# EAGLE design merkur-22m0 (EAGLE 6.3)
REVISION: 1.0
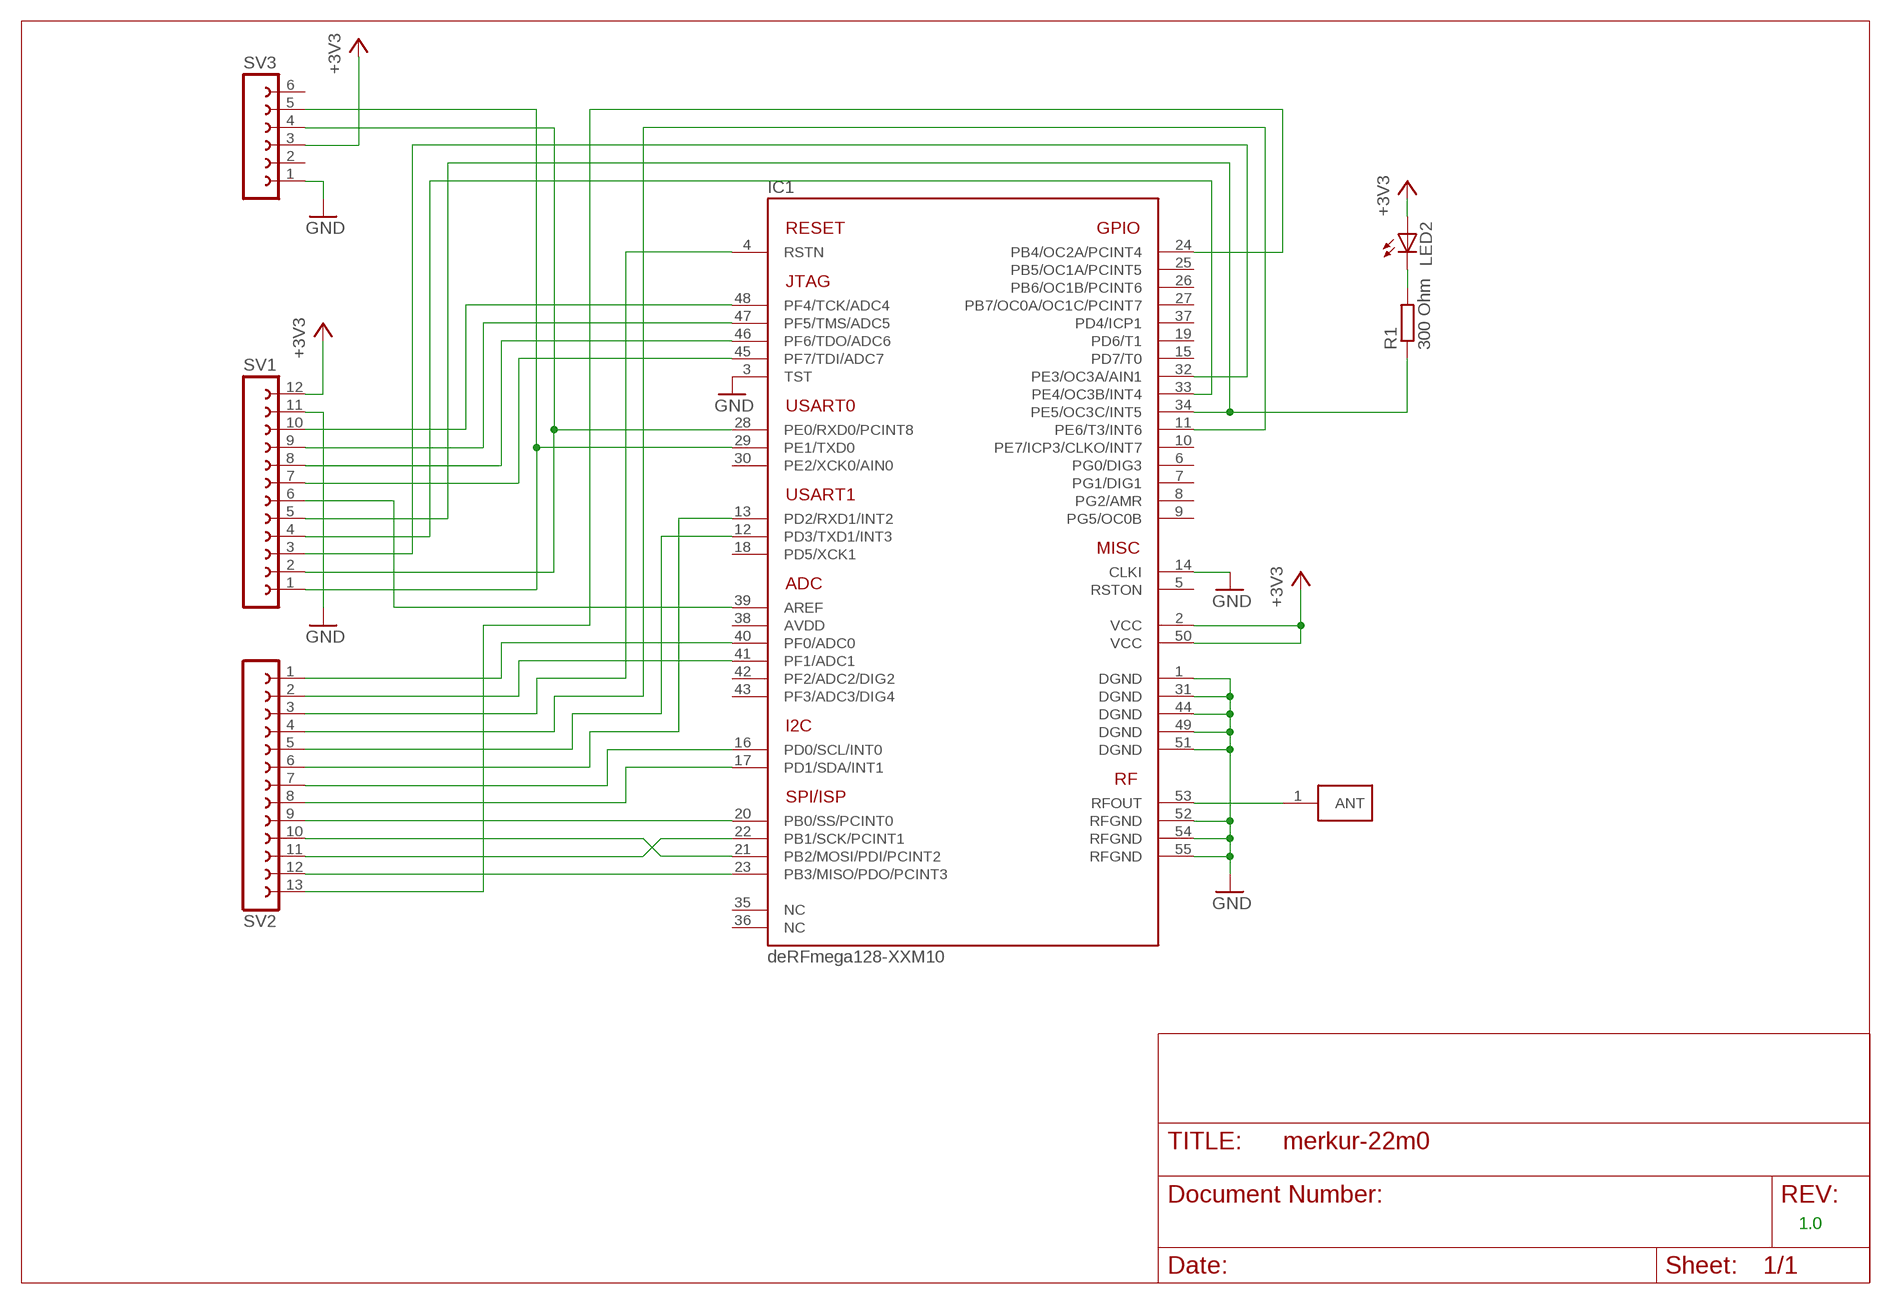
[diagram p0: schematic, sheet 1]

## Parts
IC1  DERFMEGA128-XXM10  [A-M10]
LED2  LEDCHIP-LED0603  [CHIP-LED0603]
R1  300 Ohm  R-EU_R0603  [R0603]
SV1  FE12-1  [FE12]
SV2  FE13-1  [FE13]
SV3  FE06-1  [FE06]
U$1  PAD  [FE05-1]

## Nets
+3V3: IC1.2(VCC) IC1.50(VCC) LED2.A SV1.12 SV3.3
GND: IC1.1(DGND) IC1.3(TST) IC1.14(CLKI) IC1.31(DGND) IC1.44(DGND) IC1.49(DGND) IC1.51(DGND) IC1.52(RFGND) IC1.54(RFGND) IC1.55(RFGND) SV1.11 SV3.1
N$1: IC1.29(PE1/TXD0) SV1.1 SV3.5
N$2: IC1.28(PE0/RXD0/PCINT8) SV1.2 SV3.4
N$3: IC1.45(PF7/TDI/ADC7) SV1.7
N$4: IC1.46(PF6/TDO/ADC6) SV1.8
N$5: IC1.47(PF5/TMS/ADC5) SV1.9
N$6: IC1.48(PF4/TCK/ADC4) SV1.10
N$7: IC1.4(RSTN) SV2.3
N$8: IC1.34(PE5/OC3C/INT5) R1.1 SV1.5
N$9: IC1.33(PE4/OC3B/INT4) SV1.4
N$10: IC1.32(PE3/OC3A/AIN1) SV1.3
N$11: IC1.17(PD1/SDA/INT1) SV2.8
N$12: IC1.16(PD0/SCL/INT0) SV2.7
N$13: IC1.20(PB0/SS/PCINT0) SV2.9
N$14: IC1.22(PB1/SCK/PCINT1) SV2.11
N$15: IC1.21(PB2/MOSI/PDI/PCINT2) SV2.10
N$16: IC1.23(PB3/MISO/PDO/PCINT3) SV2.12
N$17: IC1.13(PD2/RXD1/INT2) SV2.6
N$18: IC1.12(PD3/TXD1/INT3) SV2.5
N$19: IC1.11(PE6/T3/INT6) SV2.4
N$20: IC1.41(PF1/ADC1) SV2.2
N$21: IC1.40(PF0/ADC0) SV2.1
N$22: IC1.39(AREF) SV1.6
N$23: LED2.C R1.2
N$24: IC1.24(PB4/OC2A/PCINT4) SV2.13
RFOUT: IC1.53(RFOUT) U$1.1(ANT)
Unconnected: IC1.5(RSTON) IC1.6(PG0/DIG3) IC1.7(PG1/DIG1) IC1.8(PG2/AMR) IC1.9(PG5/OC0B) IC1.10(PE7/ICP3/CLKO/INT7) IC1.15(PD7/T0) IC1.18(PD5/XCK1) IC1.19(PD6/T1) IC1.25(PB5/OC1A/PCINT5) IC1.26(PB6/OC1B/PCINT6) IC1.27(PB7/OC0A/OC1C/PCINT7) IC1.30(PE2/XCK0/AIN0) IC1.35(NC) IC1.36(NC) IC1.37(PD4/ICP1) IC1.38(AVDD) IC1.42(PF2/ADC2/DIG2) IC1.43(PF3/ADC3/DIG4) SV3.2 SV3.6

## Library data of the parts
IC1 = deRFmodules:DERFMEGA128-XXM10: deRFmega128 IEEE 802.15.4 Low Power Wireless Radio Module Microcontroller: Atmel ATmega128RFA1 Transceiver: integrated Manufacturer: dresden elektronik ingenieurtechnik gmbh Website: http://www.dresden-elektronik.de
LED2 = led:LED: LED OSRAM: - CHIPLED LG R971, LG N971, LY N971, LG Q971, LY Q971, LO R971, LY R971 LH N974, LH R974 LS Q976, LO Q976, LY Q976 LO Q996 - Hyper CHIPLED LW Q18S LB Q993, LB Q99A, LB R99A - SideLED LS A670, LO A670, LY A670, LG A670, LP A670 LB A673, LV A673, LT A673, LW A673 LH A674 LY A675 LS A676, LA A676, LO A676, LY A676, LW A676 LS A679, LY A679, LG A679 - Hyper Micro SIDELED® LS Y876, LA Y876, LO Y876, LY Y876 LT Y87S - SmartLED LW L88C, LW L88S LB L89C, LB L89S, LG L890 LS L89K, LO L89K, LY L89K LS L896, LA L896, LO L896, LY L896 - TOPLED LS T670, LO T670, LY T670, LG T670, LP T670 LSG T670, LSP T670, LSY T670, LOP T670, LYG T670 LG T671, LOG T671, LSG T671 LB T673, LV T673, LT T673, LW T673 LH T674 LS T676, LA T676, LO T676, LY T676, LB T676, LH T676, LSB T676, LW T676 LB T67C, LV T67C, LT T67C, LS T67K, LO T67K, LY T67K, LW E67C LS E67B, LA E67B, LO E67B, LY E67B, LB E67C, LV E67C, LT E67C LW T67C LS T679, LY T679, LG T679 LS T770, LO T770, LY T770, LG T770, LP T770 LB T773, LV T773, LT T773, LW T773 LH T774 LS E675, LA E675, LY E675, LS T675 LS T776, LA T776, LO T776, LY T776, LB T776 LHGB T686 LT T68C, LB T68C - Hyper Mini TOPLED® LB M676 - Mini TOPLED Santana® LG M470 LS M47K, LO M47K, LY M47K Source: http://www.osram.convergy.de LUXEON: - LUMILED® LXK2-PW12-R00, LXK2-PW12-S00, LXK2-PW14-U00, LXK2-PW14-V00 LXK2-PM12-R00, LXK2-PM12-S00, LXK2-PM14-U00 LXK2-PE12-Q00, LXK2-PE12-R00, LXK2-PE12-S00, LXK2-PE14-T00, LXK2-PE14-U00 LXK2-PB12-K00, LXK2-PB12-L00, LXK2-PB12-M00, LXK2-PB14-N00, LXK2-PB14-P00, LXK2-PB14-Q00 LXK2-PR12-L00, LXK2-PR12-M00, LXK2-PR14-Q00, LXK2-PR14-R00 LXK2-PD12-Q00, LXK2-PD12-R00, LXK2-PD12-S00 LXK2-PH12-R00, LXK2-PH12-S00 LXK2-PL12-P00, LXK2-PL12-Q00, LXK2-PL12-R00 Source: www.luxeon.com KINGBRIGHT: KA-3528ASYC Source: www.kingbright.com
R1 = rcl:R-EU_: RESISTOR, European symbol
SV1 = con-lsta:FE12-1: FEMALE HEADER; OC_FARNELL: unknown; OC_NEWARK: unknown
SV2 = con-lsta:FE13-1: FEMALE HEADER; OC_FARNELL: unknown; OC_NEWARK: unknown
SV3 = con-lsta:FE06-1: FEMALE HEADER; OC_FARNELL: unknown; OC_NEWARK: unknown
U$1 = Pad:PAD

## Board
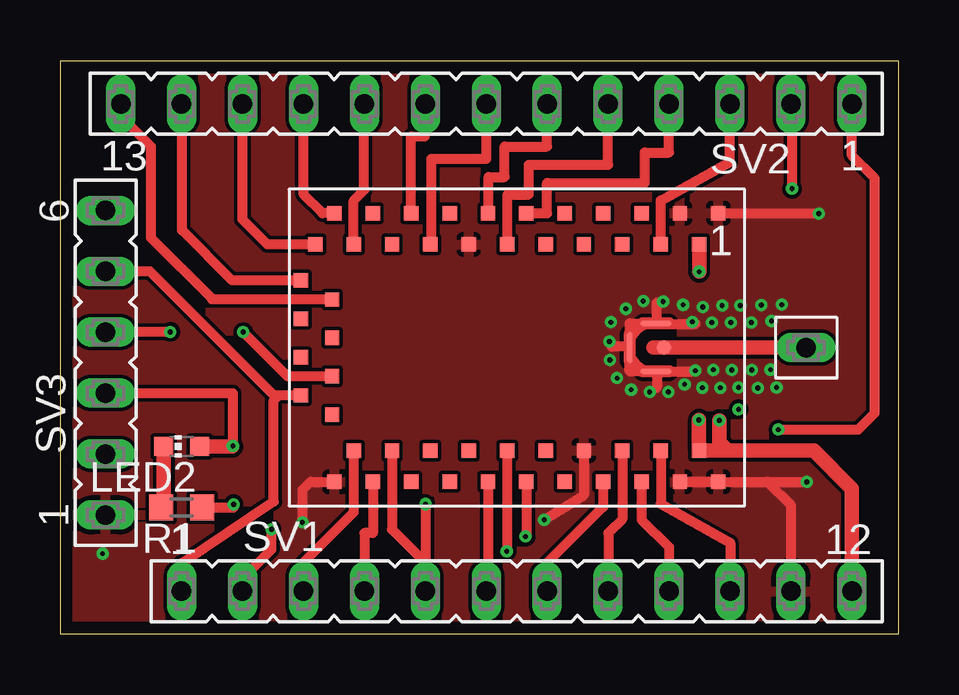
[diagram p1: board, top side]
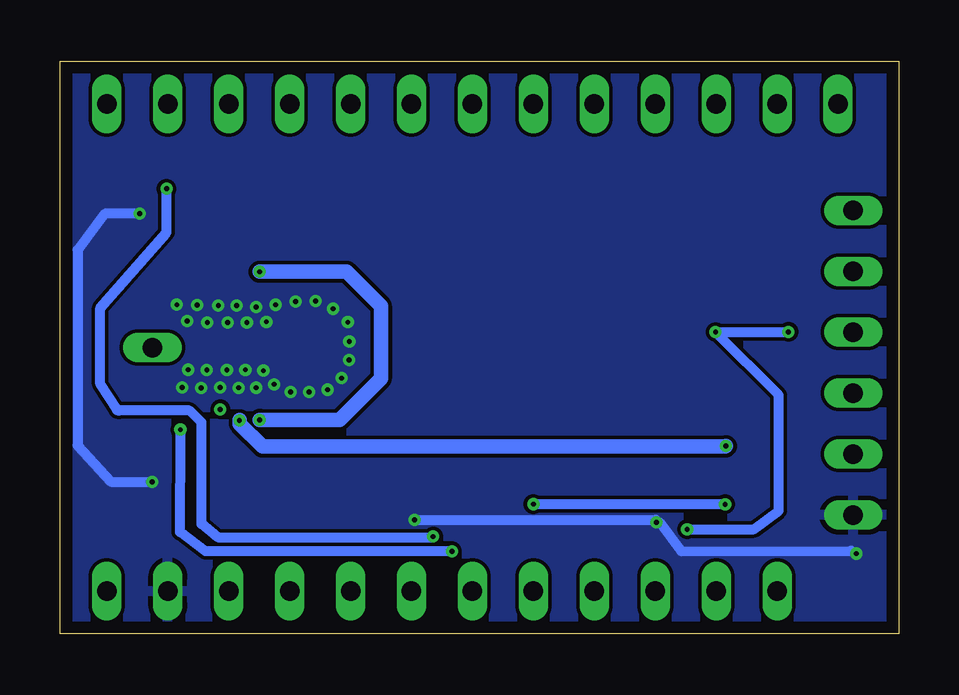
[diagram p2: board, bottom side, seen from below]

Size 34.97 x 23.87 mm. Coordinates in mm from the lower left corner, seen from the top.
Outline: 0,0 34.97,0 34.97,23.87 0,23.87 0,0
Copper layers (1*16): Top 0.035mm / dielectric 1.5mm / Bottom 0.035mm
Design rules "PCB-POOL": minimum track width 6mil, minimum drill 12mil, track to track 6mil, track to pad 6mil, pad to pad 6mil, via to via 6mil, smd to smd 6mil, copper to edge 20mil, drill to drill 8mil, minimum pad ring 8mil, minimum via ring 6mil, stop-mask expansion 3mil, vias tented up to drill 0mil, thermal gap 8mil

### Footprints (pad centres in the part's own frame; a part is rotated, then mirrored left to right if it is on the bottom)
A-M10 = smd 0.6 x 0.6: 1 -8.4,-5.6; 2 -7.6,-4.3; 3 -6.8,-5.6; 4 -6,-4.3; 5 -5.2,-5.6; 6 -4.4,-4.3; 7 -3.6,-5.6; 8 -2.8,-4.3; 9 -2,-5.6; 10 -1.2,-4.3; 11 -0.4,-5.6; 12 0.4,-4.3; 13 1.2,-5.6; 14 2,-4.3; 15 2.8,-5.6; 16 3.6,-4.3; 17 4.4,-5.6; 18 5.2,-4.3; 19 6,-5.6; 20 6.8,-4.3; 21 7.6,-5.6; 22 8.4,-4.3; 23 9,-2.8; 24 7.7,-2; 25 9,-1.2; 26 7.7,-0.4; 27 9,0.4; 28 7.7,1.2; 29 9,2; 30 7.7,2.8; 31 7.6,5.6; 32 6.8,4.3; 33 6,5.6; 34 5.2,4.3; 35 4.4,5.6; 36 3.6,4.3; 37 2.8,5.6; 38 2,4.3; 39 1.2,5.6; 40 0.4,4.3; 41 -0.4,5.6; 42 -1.2,4.3; 43 -2,5.6; 44 -2.8,4.3; 45 -3.6,5.6; 46 -4.4,4.3; 47 -5.2,5.6; 48 -6,4.3; 49 -6.8,5.6; 50 -7.6,4.3; 51 -8.4,5.6; 53 -6.14,0 | smd 1.3 x 0.2: 52 -5.8,1; 54 -5.8,-1 | smd 0.2 x 1.3: 55 -4.7,0
CHIP-LED0603 = smd 0.8 x 0.8: A 0,-0.75; C 0,0.75
R0603 = smd 1 x 1.1: 1 -0.85,0; 2 0.85,0
FE12 = drill 0.813 long: 1 -13.97,0; 2 -11.43,0; 3 -8.89,0; 4 -6.35,0; 5 -3.81,0; 6 -1.27,0; 7 1.27,0; 8 3.81,0; 9 6.35,0; 10 8.89,0; 11 11.43,0; 12 13.97,0
FE13 = drill 0.813 long: 1 -15.24,0; 2 -12.7,0; 3 -10.16,0; 4 -7.62,0; 5 -5.08,0; 6 -2.54,0; 7 0,0; 8 2.54,0; 9 5.08,0; 10 7.62,0; 11 10.16,0; 12 12.7,0; 13 15.24,0
FE06 = drill 0.813 long: 1 -6.35,0; 2 -3.81,0; 3 -1.27,0; 4 1.27,0; 5 3.81,0; 6 6.35,0
FE05-1 = drill 0.813 long: 1 -5.08,0

### Placement (x,y rotation side)
IC1  19.04,11.94 180 top
LED2  5.07,7.81 90 top
R1  5.07,5.27 180 top
SV1  19.04,1.78 0 top
SV2  17.77,22.1 180 top
SV3  1.9,11.3 90 top
U$1  31.11,17.01 90 top

### Tracks (layer width: path | path; a pad name or v marks a point on that pad's centre or on a via)
+3V3  (via drill 0.2)
  Top 0.254: 26.66,8.76 v26.64,8.92
  Top 0.406: SV1.12 | 7.18,7.81 v7.21,7.83 7.21,10.03 SV3.3 | IC1.2
  Top 0.61: 27.83,7.64 IC1.50 v26.64,8.92 | 27.83,7.64 31.42,7.64 33.01,6.05 SV1.12 | LED2.A 7.18,7.81 | v27.49,8.9 27.49,7.98 27.83,7.64 | v26.65,15.1 IC1.2
  Bottom 0.406: 27.47,8.91 v27.49,8.9
  Bottom 0.61: 27.47,8.91 27.47,8.76 26.53,7.81 7.23,7.81 v7.21,7.83 | v26.64,8.92 23.31,8.92 21.59,10.64 21.59,13.67 23.01,15.1 v26.65,15.1
GND  (via drill 0.2)
  Top 0.406: SV1.11 30.46,5.37 29.49,6.34 IC1.51 IC1.49 31.05,6.34 v31.13,6.34 | v31.64,17.52 27.46,17.52 IC1.1 | IC1.44 21.84,5.77 v20.19,4.75 | v10.11,4.64 10.11,5.99 10.45,6.34 IC1.31 | v1.77,3.34 | v26.49,10.97 26.34,10.94 IC1.52 23.74,10.94 IC1.55 23.74,12.94 IC1.54 | 24.88,10.92 24.88,10.26 | 23.73,11.98 23.01,11.98 | 26.45,12.95 | 24.88,12.93 24.88,13.79 | 24.64,12.93 26.5,12.93
  Bottom 0.406: v31.13,6.34 32.84,6.34 34.23,7.86 34.23,16.01 33.1,17.52 v31.64,17.52 | v20.19,4.75 10.12,4.75 v10.11,4.64 9.97,4.64 9.06,3.44 1.98,3.46 v1.77,3.34
  other vias: 26.8,13.63 27.61,13.68 28.37,13.69 26.37,13.01 27.18,12.98 27.97,12.98 29.67,13.04 28.83,12.97 29.25,13.71 27.24,11.01 28.01,11 27.53,10.26 28.29,10.27 28.85,11 29.09,10.25 29.62,11.01 25.98,13.72 25.15,13.86 24.32,13.87 23.59,13.55 22.97,12.99 22.91,12.19 22.92,11.42 23.23,10.66 23.81,10.18 24.59,10.08 25.36,10.09 26.04,10.4 26.79,10.26 30.1,13.72 29.88,10.27
  pour Top: -0.99,25.34 36.18,25.19 36.18,-1 -0.99,-0.85
  pour Bottom: -0.92,25.34 36.18,25.19 36.18,-1 -0.92,-0.85
N$1
  Top 0.406: IC1.29 9.12,9.94 | 9.12,9.94 8.92,9.94 3.75,15.11 2.92,15.11 SV3.5 | SV1.1 5.07,2.94 8.91,5.51 8.91,9.73 9.12,9.94
N$2  (via drill 0.2)
  Top 0.406: IC1.28 9.48,10.74 v7.64,12.58 | v4.6,12.59 3.44,12.59 SV3.4 | SV1.2 7.61,2.31 8.82,3.52 v8.82,4.36
  Bottom 0.406: 7.61,12.56 v7.64,12.58 | v7.64,12.58 v4.61,12.58 v4.6,12.59 | v8.82,4.36 6.04,4.36 5.01,5.13 5.01,9.95 v7.64,12.58
N$3
  Top 0.406: IC1.45 22.64,5.29 20.28,2.93 20.28,1.81 SV1.7
N$4
  Top 0.406: IC1.46 23.44,4.78 22.86,4.2 SV1.8
N$5
  Top 0.406: IC1.47 24.24,4.76 25.39,3.62 SV1.9
N$6
  Top 0.406: IC1.48 25.04,5.42 27.94,3.8 SV1.10
N$7
  Top 0.406: IC1.4 25.04,18.06 27.92,19.67 27.92,22.09 SV2.3
N$8  (via drill 0.2)
  Top 0.406: IC1.34 13.84,4.35 15.24,2.96 15.24,2.83 | 15.24,2.83 SV1.5 | R1.1 7.24,5.27 v7.24,5.4 | v15.23,5.41 15.24,2.92 15.24,2.83
  Bottom 0.406: v7.24,5.4 15.26,5.4 v15.23,5.41
N$9
  Top 0.406: IC1.33 13.05,4.21 12.69,4.21 SV1.4
N$10
  Top 0.406: IC1.32 12.24,5.07 10.16,2.99 SV1.3
N$11
  Top 0.406: IC1.17 14.64,20.74 15.21,20.73 15.27,22.07 SV2.8
N$12
  Top 0.406: IC1.16 15.49,16.24 15.49,19.81 17.77,19.81 SV2.7
N$13
  Top 0.406: IC1.20 12.24,18.06 12.68,18.5 12.68,22.09 SV2.9
N$14
  Top 0.406: IC1.22 8.65,16.24 7.61,17.28 SV2.11
N$15
  Top 0.406: IC1.21 10.94,17.54 10.16,18.32 10.16,22.09 SV2.10
N$16
  Top 0.406: IC1.23 7.18,14.74 5.09,16.83 5.09,22.08 SV2.12
N$17
  Top 0.406: IC1.13 17.87,17.54 17.87,19.05 18.53,19.05 18.53,20.32 20.31,20.32 SV2.6
N$18
  Top 0.406: IC1.12 18.66,16.24 18.66,18.31 19.55,18.31 19.55,19.56 22.85,19.56 SV2.5
N$19
  Top 0.406: IC1.11 20.31,17.54 20.31,18.8 24.38,18.8 24.38,20.07 25.39,20.07 SV2.4
N$20  (via drill 0.2)
  Top 0.406: IC1.41 19.44,4.04 v19.41,4.05 | v30.52,18.56 30.52,22.05 SV2.2
  Bottom 0.406: v19.41,4.05 19.48,4.03 28.39,4.03 29.07,4.58 29.07,8.81 29.57,9.31 32.52,9.31 32.53,9.33 32.59,9.33 33.29,10.41 33.29,13.59 30.53,16.73 v30.53,18.56 v30.52,18.56
N$21  (via drill 0.2)
  Top 0.406: IC1.40 18.64,3.46 v18.63,3.44 | v29.95,8.51 v29.96,8.52 33.27,8.52 33.96,9.21 33.96,18.99 33.02,19.94 SV2.1
  Bottom 0.406: v18.63,3.44 28.9,3.44 29.96,4.25 29.95,8.33 v29.95,8.51
N$22
  Top 0.406: IC1.39 17.84,1.85 SV1.6
N$23
  Top 0.61: LED2.C 4.32,5.37 R1.2
N$24
  Top 0.406: IC1.24 6.34,13.94 6.34,13.97 3.8,16.51 3.8,20.32 2.53,21.59 SV2.13
N$26  (via drill 0.2)
  other vias: 28.29,9.36
RFOUT
  Top 0.61: IC1.53 U$1.1